# Altium schematic sheet FUC.SchDoc
size A4
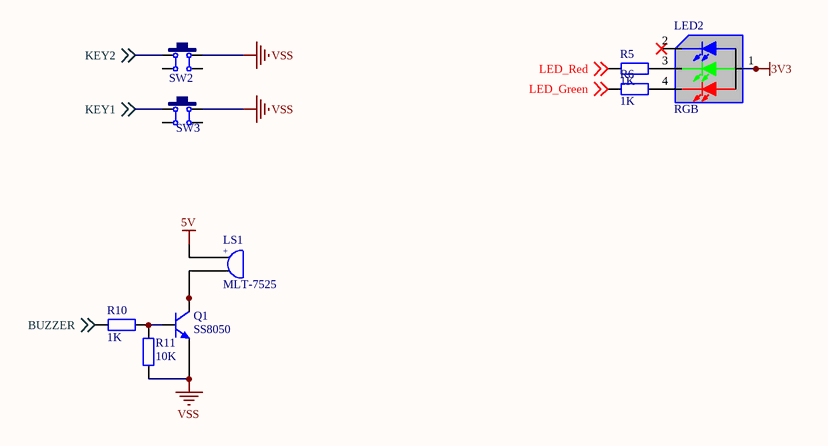
[diagram p0: FUC.SchDoc]

## Parts
LED2  RGB  [LED 3528-RGB]
LS1  MLT-7525  [BUZZER_7525_S]
Q1  SS8050  [SOT23-3L]
R5  1K  [R 0603_L]
R6  1K  [R 0603_L]
R10  1K  [R 0603_L]
R11  10K  [R 0603_L]
SW2  3.2x4.2x2.5  [TSW SMD-3*4*2]  (value not drawn)
SW3  3.2x4.2x2.5  [TSW SMD-3*4*2]  (value not drawn)

## Nets
3V3: LED2.1
5V: LS1.1
VSS: Q1.2(E) R11.2 SW2.1 SW3.1
BUZZER: R10.1 ; off-sheet BUZZER
KEY1: SW3.2 ; off-sheet KEY1
KEY2: SW2.2 ; off-sheet KEY2
LED_Green: R6.1 ; off-sheet LED_Green
LED_Red: R5.1 ; off-sheet LED_Red
NetLED2_3: LED2.3 R5.2
NetLED2_4: LED2.4 R6.2
NetLS1_2: LS1.2 Q1.3(C)
NetQ1_1: Q1.1(B) R10.2 R11.1

Not connected (* = marked no-connect by the designer): LED2 2*; SW2 3 4; SW3 3 4

## Notes on the sheet
- (in symbol Buzzer) +

## Library data of the parts
LED2 = LED-RGB-A: 共阳三基色LED; BOM名称: 三基色LED; 版权归属: 源创客; 学习资源: www.ooocke.com
LS1 = Buzzer: 蜂鸣器; 版权归属: 源创客; BOM名称: 蜂鸣器; 学习资源: www.ooocke.com
Q1 = 8050-SMD: 高频放大-NPN型; 版权归属: 源创客; 属性: 40V 1.5A 1W 100MHZ; BOM名称: 高频放大-NPN型; 学习资源: www.ooocke.com
R5 R6 R10 R11 = R: 贴片电阻; 版权归属: 源创客; BOM名称: 贴片电阻; 学习资源: www.ooocke.com
SW2 SW3 = TSW SMD-3x4_D: 3.2x4.2轻触开关; BOM名称: 3x6轻触开关; 版权归属: 源创客; 学习资源: www.ooocke.com